# Altium schematic sheet Ethernet - LAN8720A.SchDoc
size A4; SheetNumber: 3; SheetTotal: 8
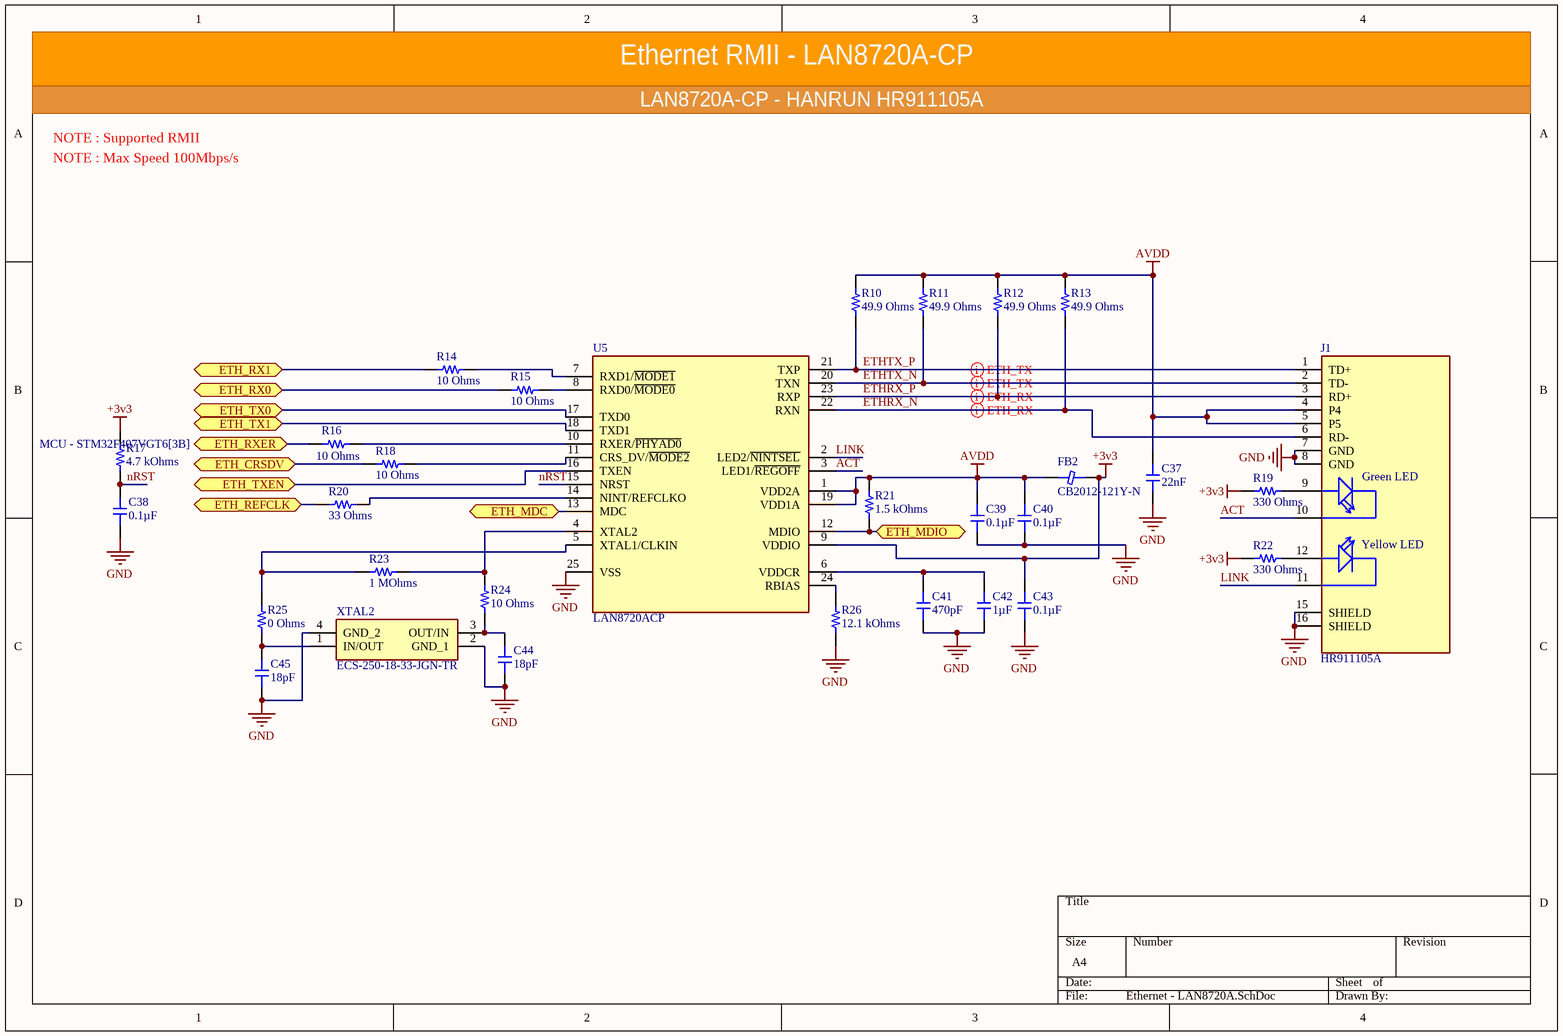
[diagram p0: Ethernet - LAN8720A.SchDoc]

## Parts
C37  22nF  [0603_Footprint]
C38  0.1µF  [0603_Footprint]
C39  0.1µF  [0603_Footprint]
C40  0.1µF  [0603_Footprint]
C41  470pF  [0603_Footprint]
C42  1µF  [0603_Footprint]
C43  0.1µF  [0603_Footprint]
C44  18pF  [0603_Footprint]
C45  18pF  [0603_Footprint]
FB2  CB2012-121Y-N  [Inductor-0603]
J1  HR911105A  [HANRUN_HR911105A]
R10  49.9 Ohms  [0603_RES]
R11  49.9 Ohms  [0603_RES]
R12  49.9 Ohms  [0603_RES]
R13  49.9 Ohms  [0603_RES]
R14  10 Ohms  [0603_RES]
R15  10 Ohms  [0603_RES]
R16  10 Ohms  [0603_RES]
R17  4.7 kOhms  [0603_RES]
R18  10 Ohms  [0603_RES]
R19  330 Ohms  [0603_RES]
R20  33 Ohms  [0603_RES]
R21  1.5 kOhms  [0603_RES]
R22  330 Ohms  [0603_RES]
R23  1 MOhms  [0603_RES]
R24  10 Ohms  [0603_RES]
R25  0 Ohms  [0603_RES]
R26  12.1 kOhms  [0603_RES]
U5  LAN8720ACP  [QFN50P400X400X100-25N-D]
XTAL2  ECS-250-18-33-JGN-TR  [ECS2501833JGNTR]

## Ports
ETH_CRSDV (bidir, see MCU - STM32F407VGT6[1B]), ETH_MDC (bidir, see MCU - STM32F407VGT6[3A]), ETH_MDIO (bidir, see MCU - STM32F407VGT6[1A]), ETH_REFCLK (bidir, see MCU - STM32F407VGT6[1A]), ETH_RX0 (bidir, see MCU - STM32F407VGT6[3A]), ETH_RX1 (bidir, see MCU - STM32F407VGT6[3A]), ETH_RXER (bidir, see MCU - STM32F407VGT6[3B]), ETH_TX0 (bidir, see MCU - STM32F407VGT6[2A]), ETH_TX1 (bidir, see MCU - STM32F407VGT6[2A]), ETH_TXEN (bidir, see MCU - STM32F407VGT6[2A])

## Nets
+3v3: C43.1 FB2.2 R17.2 R19.2 R22.2 U5.9(VDDIO)
AVDD: C37.1 C39.1 C40.1 FB2.1 J1.4(P4) J1.5(P5) R10.2 R11.2 R12.2 R13.2 R21.1 U5.1(VDD2A) U5.19(VDD1A)
GND: C37.2 C38.2 C39.2 C40.2 C41.2 C42.1 C43.2 C44.2 C45.2 J1.7(GND) J1.8(GND) J1.15(SHIELD) J1.16(SHIELD) R26.1 U5.25(VSS) XTAL2.2(GND_1) XTAL2.4(GND_2)
ACT: J1.10(GC) U5.3(LED1/~{REGOFF})
ETH_CRSDV: R18.1 ; port ETH_CRSDV
ETH_MDC: U5.13(MDC) ; port ETH_MDC
ETH_MDIO: R21.2 U5.12(MDIO) ; port ETH_MDIO
ETH_REFCLK: R20.1 ; port ETH_REFCLK
ETH_RX0: R15.1 ; port ETH_RX0
ETH_RX1: R14.1 ; port ETH_RX1
ETH_RXER: R16.1 ; port ETH_RXER
ETH_TX0: U5.17(TXD0) ; port ETH_TX0
ETH_TX1: U5.18(TXD1) ; port ETH_TX1
ETH_TXEN: U5.16(TXEN) ; port ETH_TXEN
ETHRX_N: J1.6(RD-) R13.1 U5.22(RXN)
ETHRX_P: J1.3(RD+) R12.1 U5.23(RXP)
ETHTX_N: J1.2(TD-) R11.1 U5.20(TXN)
ETHTX_P: J1.1(TD+) R10.1 U5.21(TXP)
LINK: J1.11(YC) U5.2(LED2/~{NINTSEL})
nRST: C38.1 R17.1 U5.15(NRST)
NetC41_1: C41.1 C42.2 U5.6(VDDCR)
NetC44_1: C44.1 R24.2 XTAL2.3(OUT/IN)
NetC45_1: C45.1 R25.1 XTAL2.1(IN/OUT)
NetJ1_9: J1.9(GA) R19.1
NetJ1_12: J1.12(YA) R22.1
NetR14_2: R14.2 U5.7(RXD1/~{MODE1})
NetR15_2: R15.2 U5.8(RXD0/~{MODE0})
NetR16_2: R16.2 U5.10(RXER/~{PHYAD0})
NetR18_2: R18.2 U5.11(CRS_DV/~{MODE2})
NetR20_2: R20.2 U5.14(NINT/REFCLKO)
NetR23_1: R23.1 R25.2 U5.5(XTAL1/CLKIN)
NetR23_2: R23.2 R24.1 U5.4(XTAL2)
NetR26_2: R26.2 U5.24(RBIAS)

## Layout directives
differential pair; differential pair class ETH_TX: ETHTX_N, ETHTX_P
differential pair; differential pair class ETH_RX: ETHRX_N, ETHRX_P

## Notes on the sheet
- Ethernet RMII - LAN8720A-CP
- LAN8720A-CP - HANRUN HR911105A
- NOTE : Supported RMII
- NOTE : Max Speed 100Mbps/s
- (in symbol HR911105A) Green LED; Yellow LED

## Library data of the parts
C37 = 22nF 0603: 22nF 0603 Surface Capacitor
C38-C40 C43 = 0.1uF 0603 Surface Capacitor_1_1_1_1_1_1: 0.1uF 0603 Surface Capacitor
C41 = 470 pF 0603 Surface Capacitor
C42 = 1uF 0603 Surface Capacitor
C44 C45 = 18pF 0603 Surface Capacitor
J1 = HR911105A: DIP RJ45 Connector;; MF: hanrun; SnapEDA_Link: https://www.snapeda.com/parts/HR911105A/HanRun/view-part/?ref=snap; Package: None; MP: HR911105A; Check_prices: https://www.snapeda.com/parts/HR911105A/HanRun/view-part/?ref=eda; Price: None; Value: *; Availability: Not in stock
R10-R13 = 49.9 Ohms 0603
R14-R16 R18 R24 = 10 Ohm 0603: 10 Ohms 0603
R17 = 4.7 kOhms 0603
R19 R22 = 330 Ohm 0603
R20 = 33 Ohm 0603
R21 = 1.5 kOhms 0603
R23 = 1 MOhms 0603
R25 = 0 Ohm 0603
R26 = 12.1 kOhms 0603
U5 = LAN8720ACP: Ethernet Transreceiver; Manufacturer_Name: Microchip; Datasheet Link: http://ww1.microchip.com/downloads/en/DeviceDoc/8720a.pdf; Height: 1mm; Manufacturer_Part_Number: LAN8720ACP
XTAL2 = ECS-250-18-33-JGN-TR: Crystal or Oscillator; Manufacturer_Name: ECS; Datasheet Link: https://componentsearchengine.com/Datasheets/1/ECS-250-18-33-JGN-TR.pdf; Height: 0.8mm; Manufacturer_Part_Number: ECS-250-18-33-JGN-TR; Mouser Part Number: 520-250-18-33-JGNT; Mouser Price/Stock: https://www.mouser.co.uk/ProductDetail/ECS/ECS-250-18-33-JGN-TR?qs=AQlKX63v8RsjuKdEYMjMow%3D%3D; Arrow Part Number: ECS-250-18-33-JGN-TR; Arrow Price/Stock: https://www.arrow.com/en/products/ecs-250-18-33-jgn-tr/ecs-international?region=nac